# EAGLE design proto_shield_MEGA-REV3 (EAGLE 9.3.0)
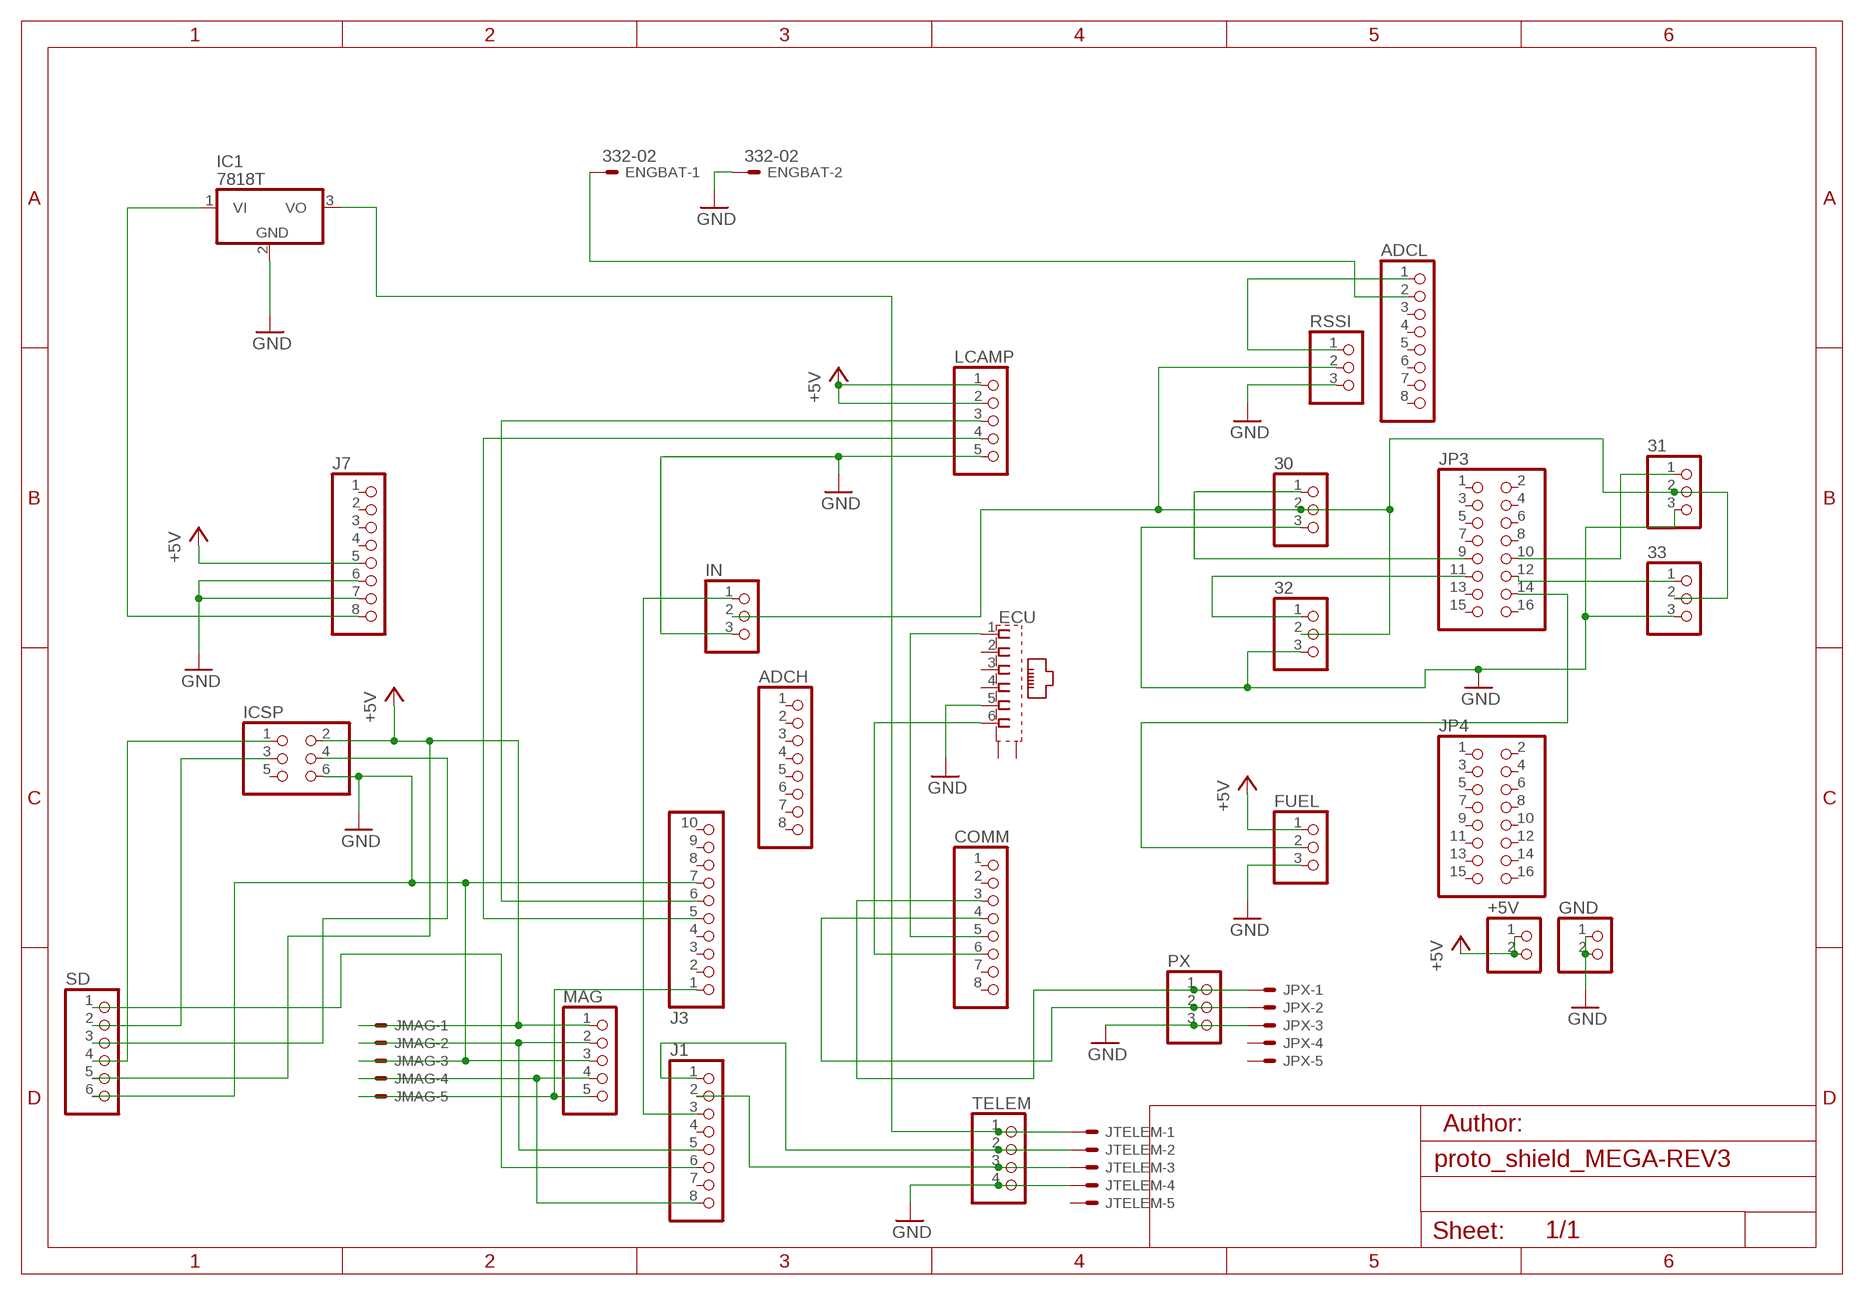
[diagram p0: schematic, sheet 1]

## Parts
30  PINHD-1X3  [1X03]
31  PINHD-1X3  [1X03]
32  PINHD-1X3  [1X03]
33  PINHD-1X3  [1X03]
+5V  PINHD-1X2  [1X02]
ADCH  PINHD-1X8TH  [1X08-TH]
ADCL  PINHD-1X8TH  [1X08-TH]
COMM  PINHD-1X8TH  [1X08-TH]
ECU  XRJK-S-01-6-6-0-2G2-NO  [XRJK-S-01-6-6-0-2G2-NO]
ENGBAT  332-02  [332-02]
FUEL  PINHD-1X3  [1X03]
GND  PINHD-1X2  [1X02]
IC1  7818T  [TO220H]
ICSP  PINHD-2X3  [2X03]
IN  PINHD-1X3  [1X03]
J1  PINHD-1X8TH  [1X08-TH]
J3  PINHD-1X10TH  [1X10-TH]
J7  PINHD-1X8TH  [1X08-TH]
JMAG  BM05B-SRSS-TB  [BM05B-SRSS-TB]
JP3  PINHD-2X8  [2X08]
JP4  PINHD-2X8  [2X08]
JPX  BM05B-SRSS-TB  [BM05B-SRSS-TB]
JTELEM  BM05B-SRSS-TB  [BM05B-SRSS-TB]
LCAMP  PINHD-1X5  [1X05]
MAG  PINHD-1X5  [1X05]
PX  PINHD-1X3  [1X03]
RSSI  PINHD-1X3  [1X03]
SD  PINHD-1X6  [1X06]
TELEM  PINHD-1X4  [1X04]

## Nets
+5V: +5V.1 +5V.2 FUEL.1 ICSP.2 J7.5 JMAG.1 LCAMP.1 LCAMP.2 MAG.1 SD.5
GND: 30.3 31.3 32.3 33.3 ECU.5 ENGBAT.2 FUEL.3 GND.1 GND.2 IC1.2(GND) ICSP.6 IN.3 J3.7 J7.6 J7.7 JMAG.3 JPX.3 JTELEM.4 LCAMP.5 MAG.3 PX.3 RSSI.3 SD.6 TELEM.4
N$1: COMM.5 ECU.1
N$2: COMM.6 ECU.6
N$3: J3.6 LCAMP.3
N$4: J3.5 LCAMP.4
N$5: J1.6 SD.1
N$6: ICSP.4 SD.3
N$7: ICSP.3 SD.2
N$8: ICSP.1 SD.4
N$9: J1.5 JMAG.2 MAG.2
N$10: J1.8 JMAG.4 MAG.4
N$11: J3.1 JMAG.5 MAG.5
N$12: IN.1 J1.3
N$13: ADCL.1 RSSI.1
N$14: ADCL.2 ENGBAT.1
N$15: 31.1 JP3.10
N$16: 33.1 JP3.12
N$17: 32.1 JP3.11
N$18: 30.1 JP3.9
N$19: COMM.3 JPX.1 PX.1
N$20: COMM.4 JPX.2 PX.2
N$21: J1.1 JTELEM.2 TELEM.2
N$22: J1.2 JTELEM.3 TELEM.3
N$23: FUEL.2 JP3.14
N$24: IC1.3(VO) JTELEM.1 TELEM.1
N$25: IC1.1(VI) J7.8
N$26: 30.2 31.2 32.2 33.2 IN.2 RSSI.2
Unconnected: ADCH.1 ADCH.2 ADCH.3 ADCH.4 ADCH.5 ADCH.6 ADCH.7 ADCH.8 ADCL.3 ADCL.4 ADCL.5 ADCL.6 ADCL.7 ADCL.8 COMM.1 COMM.2 COMM.7 COMM.8 ECU.2 ECU.3 ECU.4 ECU.S1(S) ECU.S2(S) ICSP.5 J1.4 J1.7 J3.2 J3.3 J3.4 J3.8 J3.9 J3.10 J7.1 J7.2 J7.3 J7.4 JP3.1 JP3.2 JP3.3 JP3.4 JP3.5 JP3.6 JP3.7 JP3.8 JP3.13 JP3.15 JP3.16 JP4.1 JP4.2 JP4.3 JP4.4 JP4.5 JP4.6 JP4.7 JP4.8 JP4.9 JP4.10 JP4.11 JP4.12 JP4.13 JP4.14 JP4.15 JP4.16 JPX.4 JPX.5 JTELEM.5

## Library data of the parts
30-33 FUEL IN PX RSSI = pinhead:PINHD-1X3: PIN HEADER
+5V GND = pinhead:PINHD-1X2: PIN HEADER
ADCH ADCL COMM J1 J7 = Smartprj:PINHD-1X8: PIN HEADER
ECU = con-xmultiple:XRJK*6: RJ11 Connector without LED, 6 position, 6 contacts, shielded, thrue hole Source: XRJK-S-01-6-6-0-2G2-NO(01).pdf
ENGBAT = con-garry:332-02: 2 Pin - 2mm Dual Row Source: www.mpe-connector.de / garry_shortform_2012.pdf
IC1 = linear:78*: Positive VOLTAGE REGULATOR Source: http://cache.national.com/ds/LM/LM78L05.pdf http://www.fairchildsemi.com/ds/LM/LM7805.pdf
ICSP = Smartprj:PINHD-2X3: PIN HEADER
J3 = Smartprj:PINHD-1X10: PIN HEADER
JMAG JPX JTELEM = con-jst2:?M05B-SRSS-TB: Disconnectable Crimp style connector, 1.0mm pitch 5 contacts
JP3 JP4 = pinhead:PINHD-2X8: PIN HEADER
LCAMP MAG = pinhead:PINHD-1X5: PIN HEADER
SD = pinhead:PINHD-1X6: PIN HEADER
TELEM = pinhead:PINHD-1X4: PIN HEADER

## Board
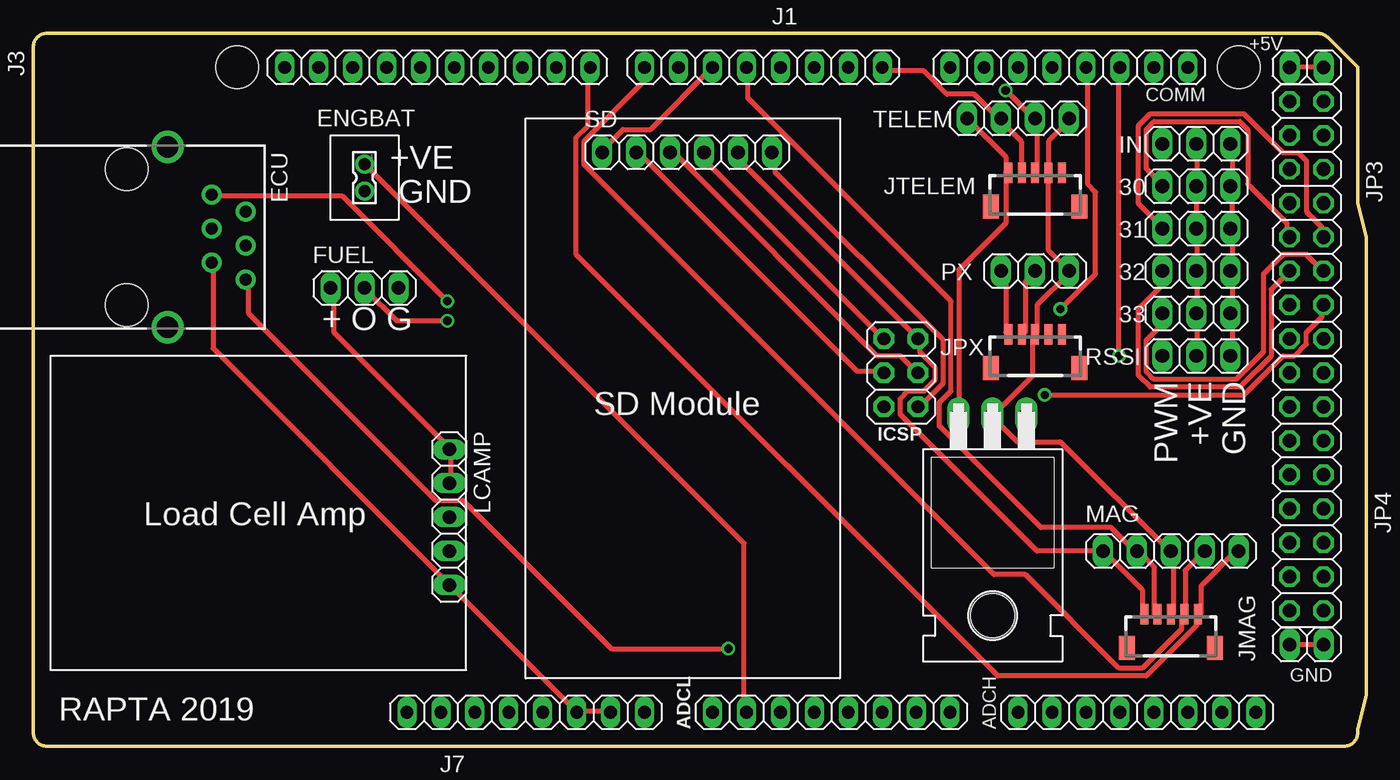
[diagram p1: board, top side]
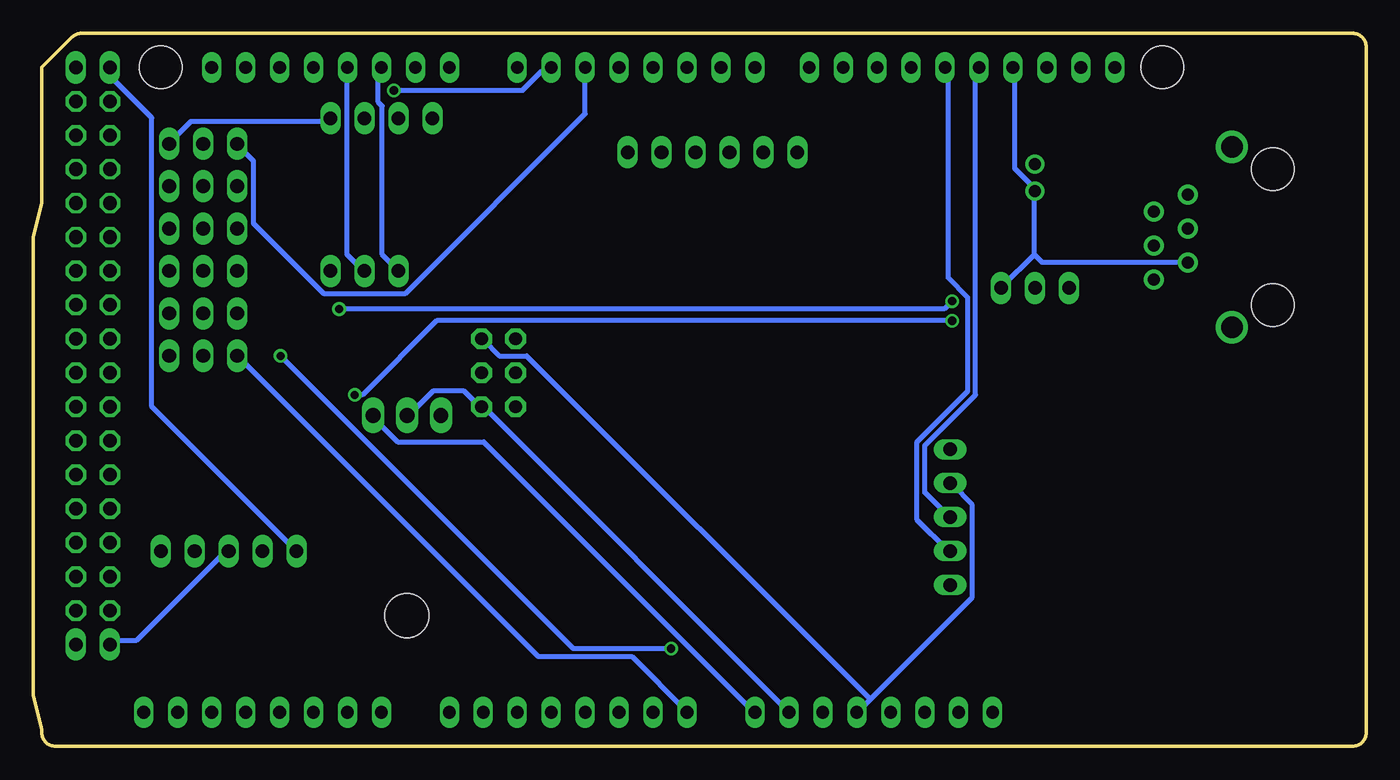
[diagram p2: board, bottom side, seen from below]

Size 99.69 x 53.34 mm. Coordinates in mm from the lower left corner, seen from the top.
Outline: 99.06,40.64 99.69,38.1 99.69,3.81 99.06,1.27 99.06,1 arc-90 98.06,0 1,0 arc-90 0,1 0,52.34 arc-90 1,53.34 96.11,53.34 arc-45 96.81,53.05 99.06,50.8 99.06,40.64
Copper layers (1*16): Top 0.035mm / dielectric 1.5mm / Bottom 0.035mm
Design rules "default *": minimum track width 15mil, minimum drill 24mil, track to track 8mil, track to pad 8mil, pad to pad 8mil, via to via 8mil, smd to smd 8mil, copper to edge 40mil, drill to drill 8mil, minimum pad ring 10mil, minimum via ring 8mil, stop-mask expansion 2mil, vias tented up to drill 0mil, thermal gap 10mil
Holes 3.2 mm at 15.24,50.8 90.17,50.8

### Footprints (pad centres in the part's own frame; a part is rotated, then mirrored left to right if it is on the bottom)
1X03 = drill 1.016 long: 1 -2.54,0; 2 0,0; 3 2.54,0
1X02 = drill 1.016 long: 1 -1.27,0; 2 1.27,0
1X08-TH = drill 0.95 pad 1.422 long: 1 -8.89,0; 2 -6.35,0; 3 -3.81,0; 4 -1.27,0; 5 1.27,0; 6 3.81,0; 7 6.35,0; 8 8.89,0
XRJK-S-01-6-6-0-2G2-NO = drill 0.9 pad 1.5: 1 -3.175,6.35; 2 -1.905,8.89; 3 -0.635,6.35; 4 0.635,8.89; 5 1.905,6.35; 6 3.175,8.89 | drill 1.6 pad 2.184: S1 -6.75,3.05; S2 6.75,3.05 | hole 3.2: -5.08,0; 5.08,0
332-02 = drill 0.9 pad 1.27: 1 0,-1; 2 0,1
TO220H = drill 1.118 long: 1 -2.54,-10.16; 2 0,-10.16; 3 2.54,-10.16 | hole 3.302: 0,4.826
2X03 = drill 0.95 pad 1.55 octagon: 1 -2.54,-1.27; 2 -2.54,1.27; 3 0,-1.27; 4 0,1.27; 5 2.54,-1.27; 6 2.54,1.27
1X10-TH = drill 0.95 pad 1.422 long: 1 -11.43,0; 2 -8.89,0; 3 -6.35,0; 4 -3.81,0; 5 -1.27,0; 6 1.27,0; 7 3.81,0; 8 6.35,0; 9 8.89,0; 10 11.43,0
BM05B-SRSS-TB = smd 0.6 x 1.55: 1 2,-1.625; 2 1,-1.625; 3 0,-1.625; 4 -1,-1.625; 5 -2,-1.625 | smd 1.2 x 1.8: FIT@1 3.3,0.9; FIT@2 -3.3,0.9
2X08 = drill 1.016 octagon: 1 -8.89,-1.27; 2 -8.89,1.27; 3 -6.35,-1.27; 4 -6.35,1.27; 5 -3.81,-1.27; 6 -3.81,1.27; 7 -1.27,-1.27; 8 -1.27,1.27; 9 1.27,-1.27; 10 1.27,1.27; 11 3.81,-1.27; 12 3.81,1.27; 13 6.35,-1.27; 14 6.35,1.27; 15 8.89,-1.27; 16 8.89,1.27
1X05 = drill 1.016 long: 1 -5.08,0; 2 -2.54,0; 3 0,0; 4 2.54,0; 5 5.08,0
1X06 = drill 1.016 long: 1 -6.35,0; 2 -3.81,0; 3 -1.27,0; 4 1.27,0; 5 3.81,0; 6 6.35,0
1X04 = drill 1.016 long: 1 -3.81,0; 2 -1.27,0; 3 1.27,0; 4 3.81,0

### Placement (x,y rotation side)
30  87,41.91 0 top
31  87,38.73 0 top
32  87,35.56 0 top
33  87,32.38 0 top
+5V  95.25,50.8 0 top
ADCH  82.55,2.54 0 top
ADCL  59.69,2.54 0 top
COMM  77.47,50.8 0 top
ECU  6.99,38.1 270 top
ENGBAT  24.77,42.55 180 top
FUEL  24.77,34.29 0 top
GND  95.25,7.62 0 top
IC1  71.75,14.61 180 top
ICSP  64.9,27.94 270 top
IN  87,45.09 0 top
J1  54.61,50.8 180 top
J3  30.23,50.8 180 top
J7  36.83,2.54 0 top
JMAG  85.09,8.26 180 top
JP3  95.25,39.37 270 top
JP4  95.25,19.05 270 top
JPX  74.93,29.21 180 top
JTELEM  74.93,41.27 180 top
LCAMP  31.11,17.14 270 top
MAG  85.09,14.61 0 top
PX  74.93,35.56 0 top
RSSI  87,29.21 0 top
SD  48.9,44.45 0 top
TELEM  73.66,46.99 0 top

### Tracks (layer width: path | path; a pad name or v marks a point on that pad's centre or on a via)
+5V
  Top 0.381: LCAMP.2 31.25,19.86 31.25,22.2 LCAMP.1 30.96,22.49 22.49,30.96 22.49,34.18 FUEL.1 | SD.5 52.87,44.4 52.87,43.81 66.02,30.67 ICSP.2 66.31,30.38 66.31,29.5 67.47,28.33 67.47,27.46 66.6,26.58 65.43,26.58 64.85,26 64.85,24.83 75.07,14.61 MAG.1 80.03,14.61 82.96,11.68 82.96,9.93 JMAG.1 | +5V.1 94.06,50.83 96.39,50.83 +5V.2
  Bottom 0.381: 37.1,3.5 29.5,11.1 29.5,18.11 30.96,19.57 LCAMP.2 | 37.1,3.5 37.97,2.63 J7.5 | +5V.1 93.76,50.53 93.76,49.95 90.84,47.03 90.84,25.41 80.03,14.61 MAG.1 | 37.1,3.5 62.8,29.21 64.85,29.21 66.02,30.38 ICSP.2
GND
  Top 0.381: J7.7 42.94,2.63 40.89,2.63 J7.6 40.6,2.63 31.25,11.98 LCAMP.5 30.96,12.27 13.44,29.79 13.44,35.93 ECU.5 | IN.3 89.67,44.98 89.67,42.06 30.3 89.67,41.77 89.67,38.85 31.3 89.67,38.56 89.67,35.64 32.3 89.67,35.34 89.67,32.42 33.3 89.67,32.13 89.67,29.21 RSSI.3 | TELEM.4 77.41,46.74 75.95,45.28 75.95,42.94 JTELEM.4 75.95,42.65 75.95,37.1 77.41,35.64 PX.3 77.41,35.34 75.07,33.01 75.07,30.96 JPX.3 74.78,30.67 74.78,27.75 71.86,24.83 IC1.2 71.86,24.54 73.61,22.78 76.82,22.78 85,14.61 MAG.3 85.29,14.61 85.29,9.93 JMAG.3 | GND.1 94.06,7.59 96.39,7.59 GND.2 | SD.6 55.5,44.4 55.5,42.94 68.06,30.38 68.06,27.16 66.31,25.41 ICSP.6
  Bottom 0.381: 24.83,36.8 24.83,41.48 ENGBAT.2 24.83,41.77 26.29,43.23 26.29,50.53 J3.7 | 24.83,36.8 27.16,34.47 FUEL.3 | 24.83,36.8 24.24,36.22 13.44,36.22 ECU.5 | IN.3 89.38,45.28 87.92,46.74 77.7,46.74 TELEM.4 | GND.1 93.76,7.89 92.01,7.89 85.29,14.61 MAG.3 | IC1.2 71.56,24.83 69.81,26.58 67.47,26.58 66.31,25.41 ICSP.6 66.02,25.41 43.23,2.63 J7.7
N$1  (via drill 0.61)
  Top 0.381: v76.82,32.72 79.45,35.34 79.45,41.48 78.87,42.06 78.87,50.53 COMM.5 | v30.96,33.3 23.08,41.19 13.44,41.19 ECU.1
  Bottom 0.381: v76.82,32.72 31.55,32.72 v30.96,33.3
N$2  (via drill 0.61)
  Top 0.381: v81.2,29.21 81.2,50.53 COMM.6 | v51.99,7.3 43.23,7.3 32.13,18.4 30.09,18.4 16.07,32.42 16.07,34.76 ECU.6
  Bottom 0.381: v81.2,29.21 59.3,7.3 v51.99,7.3
N$3
  Bottom 0.381: J3.6 29.21,50.53 29.21,26.29 33.01,22.49 33.01,18.99 31.25,17.23 LCAMP.3
N$4
  Bottom 0.381: J3.5 31.25,50.53 31.25,35.05 29.79,33.59 29.79,26.58 33.59,22.78 33.59,16.94 31.25,14.61 LCAMP.4
N$5
  Top 0.381: J1.6 46.15,46.15 44.11,46.15 42.65,44.69 SD.1
N$6
  Top 0.381: SD.3 47.9,44.4 63.09,29.21 64.85,29.21 66.02,28.04 ICSP.4
N$7
  Top 0.381: SD.2 45.28,44.4 61.63,28.04 63.39,28.04 ICSP.3
N$8
  Top 0.381: SD.4 50.24,44.4 50.24,43.81 63.39,30.67 ICSP.1
N$9
  Top 0.381: JMAG.2 83.83,9.93 83.83,13.44 82.66,14.61 MAG.2 82.37,14.61 80.62,16.36 75.36,16.36 67.77,23.95 67.77,25.7 68.64,26.58 68.64,33.3 53.45,48.49 53.45,50.53 J1.5
N$10
  Top 0.381: MAG.4 86.17,13.14 86.17,9.93 JMAG.4 85.88,9.64 85.88,8.76 82.96,5.84 81.2,5.84 74.19,12.85 71.86,12.85 41.19,43.52 41.19,45.28 45.57,49.66 45.57,50.53 J1.8
N$11
  Top 0.381: MAG.5 89.97,14.61 87.34,11.98 87.34,9.93 JMAG.5 87.05,9.64 87.05,9.05 83.25,5.26 72.15,5.26 40.6,36.8 40.6,45.57 41.48,46.44 41.48,50.53 J3.1
N$12
  Bottom 0.381: J1.3 58.42,47.32 71.86,33.88 77.99,33.88 83.25,39.14 83.25,43.81 84.42,44.98 IN.1
N$13
  Bottom 0.381: ADCL.1 50.83,2.63 54.91,6.72 61.92,6.72 84.42,29.21 RSSI.1
N$14
  Top 0.381: ENGBAT.1 24.83,43.52 53.16,15.19 53.16,2.63 ADCL.2
N$15
  Top 0.381: JP3.10 96.39,38.27 96.39,38.85 95.22,40.02 95.22,43.81 94.64,44.4 93.47,44.4 90.55,47.32 83.54,47.32 82.66,46.44 82.66,40.6 84.42,38.85 31.1
N$16
  Top 0.381: 33.1 84.42,32.13 84.42,31.55 83.25,30.38 83.25,28.04 83.83,27.46 89.97,27.46 92.01,29.5 92.01,35.34 93.47,36.8 95.22,36.8 96.39,35.64 JP3.12
N$17
  Top 0.381: JP3.11 92.6,34.18 92.6,29.21 90.26,26.87 83.54,26.87 82.66,27.75 82.66,32.72 84.42,34.47 84.42,35.34 32.1
N$18
  Top 0.381: JP3.9 93.76,38.27 93.76,39.14 90.84,42.06 90.84,46.15 90.26,46.74 83.83,46.74 83.25,46.15 83.25,43.23 84.42,42.06 30.1
N$19
  Top 0.381: JPX.1 72.73,30.96 72.73,35.05 72.44,35.34 PX.1
  Bottom 0.381: COMM.3 73.9,50.53 73.9,48.2 73.61,47.9 73.61,36.8 72.44,35.64 PX.1
N$20
  Top 0.381: JPX.2 74.19,30.96 74.19,34.76 74.78,35.34 PX.2
  Bottom 0.381: COMM.4 76.24,50.53 76.24,36.8 75.07,35.64 PX.2
N$21
  Top 0.381: JTELEM.2 73.9,42.94 73.9,45.28 72.44,46.74 TELEM.2 72.15,47.03 70.4,48.78 68.35,48.78 66.6,50.53 63.68,50.53 J1.1
N$22  (via drill 0.61)
  Top 0.381: JTELEM.3 75.07,42.94 75.07,46.74 TELEM.3 74.78,47.03 v72.73,49.07
  Bottom 0.381: v72.73,49.07 63.09,49.07 61.63,50.53 61.05,50.53 J1.2
N$23  (via drill 0.61)
  Top 0.381: v75.65,26.29 90.55,26.29 93.47,29.21 94.35,29.21 95.22,30.09 95.22,30.96 96.39,32.13 96.39,33.01 JP3.14 | v30.96,31.84 27.16,31.84 24.83,34.18 FUEL.2
  Bottom 0.381: v75.65,26.29 75.07,26.29 69.52,31.84 v30.96,31.84
N$24
  Top 0.381: TELEM.1 72.73,44.11 72.73,42.94 JTELEM.1 72.73,42.65 72.73,39.14 69.23,35.64 69.23,24.83 IC1.3
N$25
  Bottom 0.381: J7.8 45.86,2.63 66.02,22.78 72.44,22.78 74.19,24.54 IC1.1
N$26
  Top 0.381: IN.2 87.05,44.98 87.05,42.06 30.2 87.05,41.77 87.05,38.85 31.2 87.05,38.56 87.05,35.64 32.2 87.05,35.34 87.05,32.42 33.2 87.05,32.13 87.05,29.21 RSSI.2

### Text on the board
tPlace: SD Module | Load Cell Amp
tNames: +VE | GND | + O G | PWM | +VE | GND | RAPTA 2019
bStop: 5V | 31 | 33 | 35 | 37 | 39 | 41 | 43 | 45 | 47 | 49 | 51 | 53 | GND